# EAGLE design SkinProc_v0_1b (EAGLE 7.2.0)
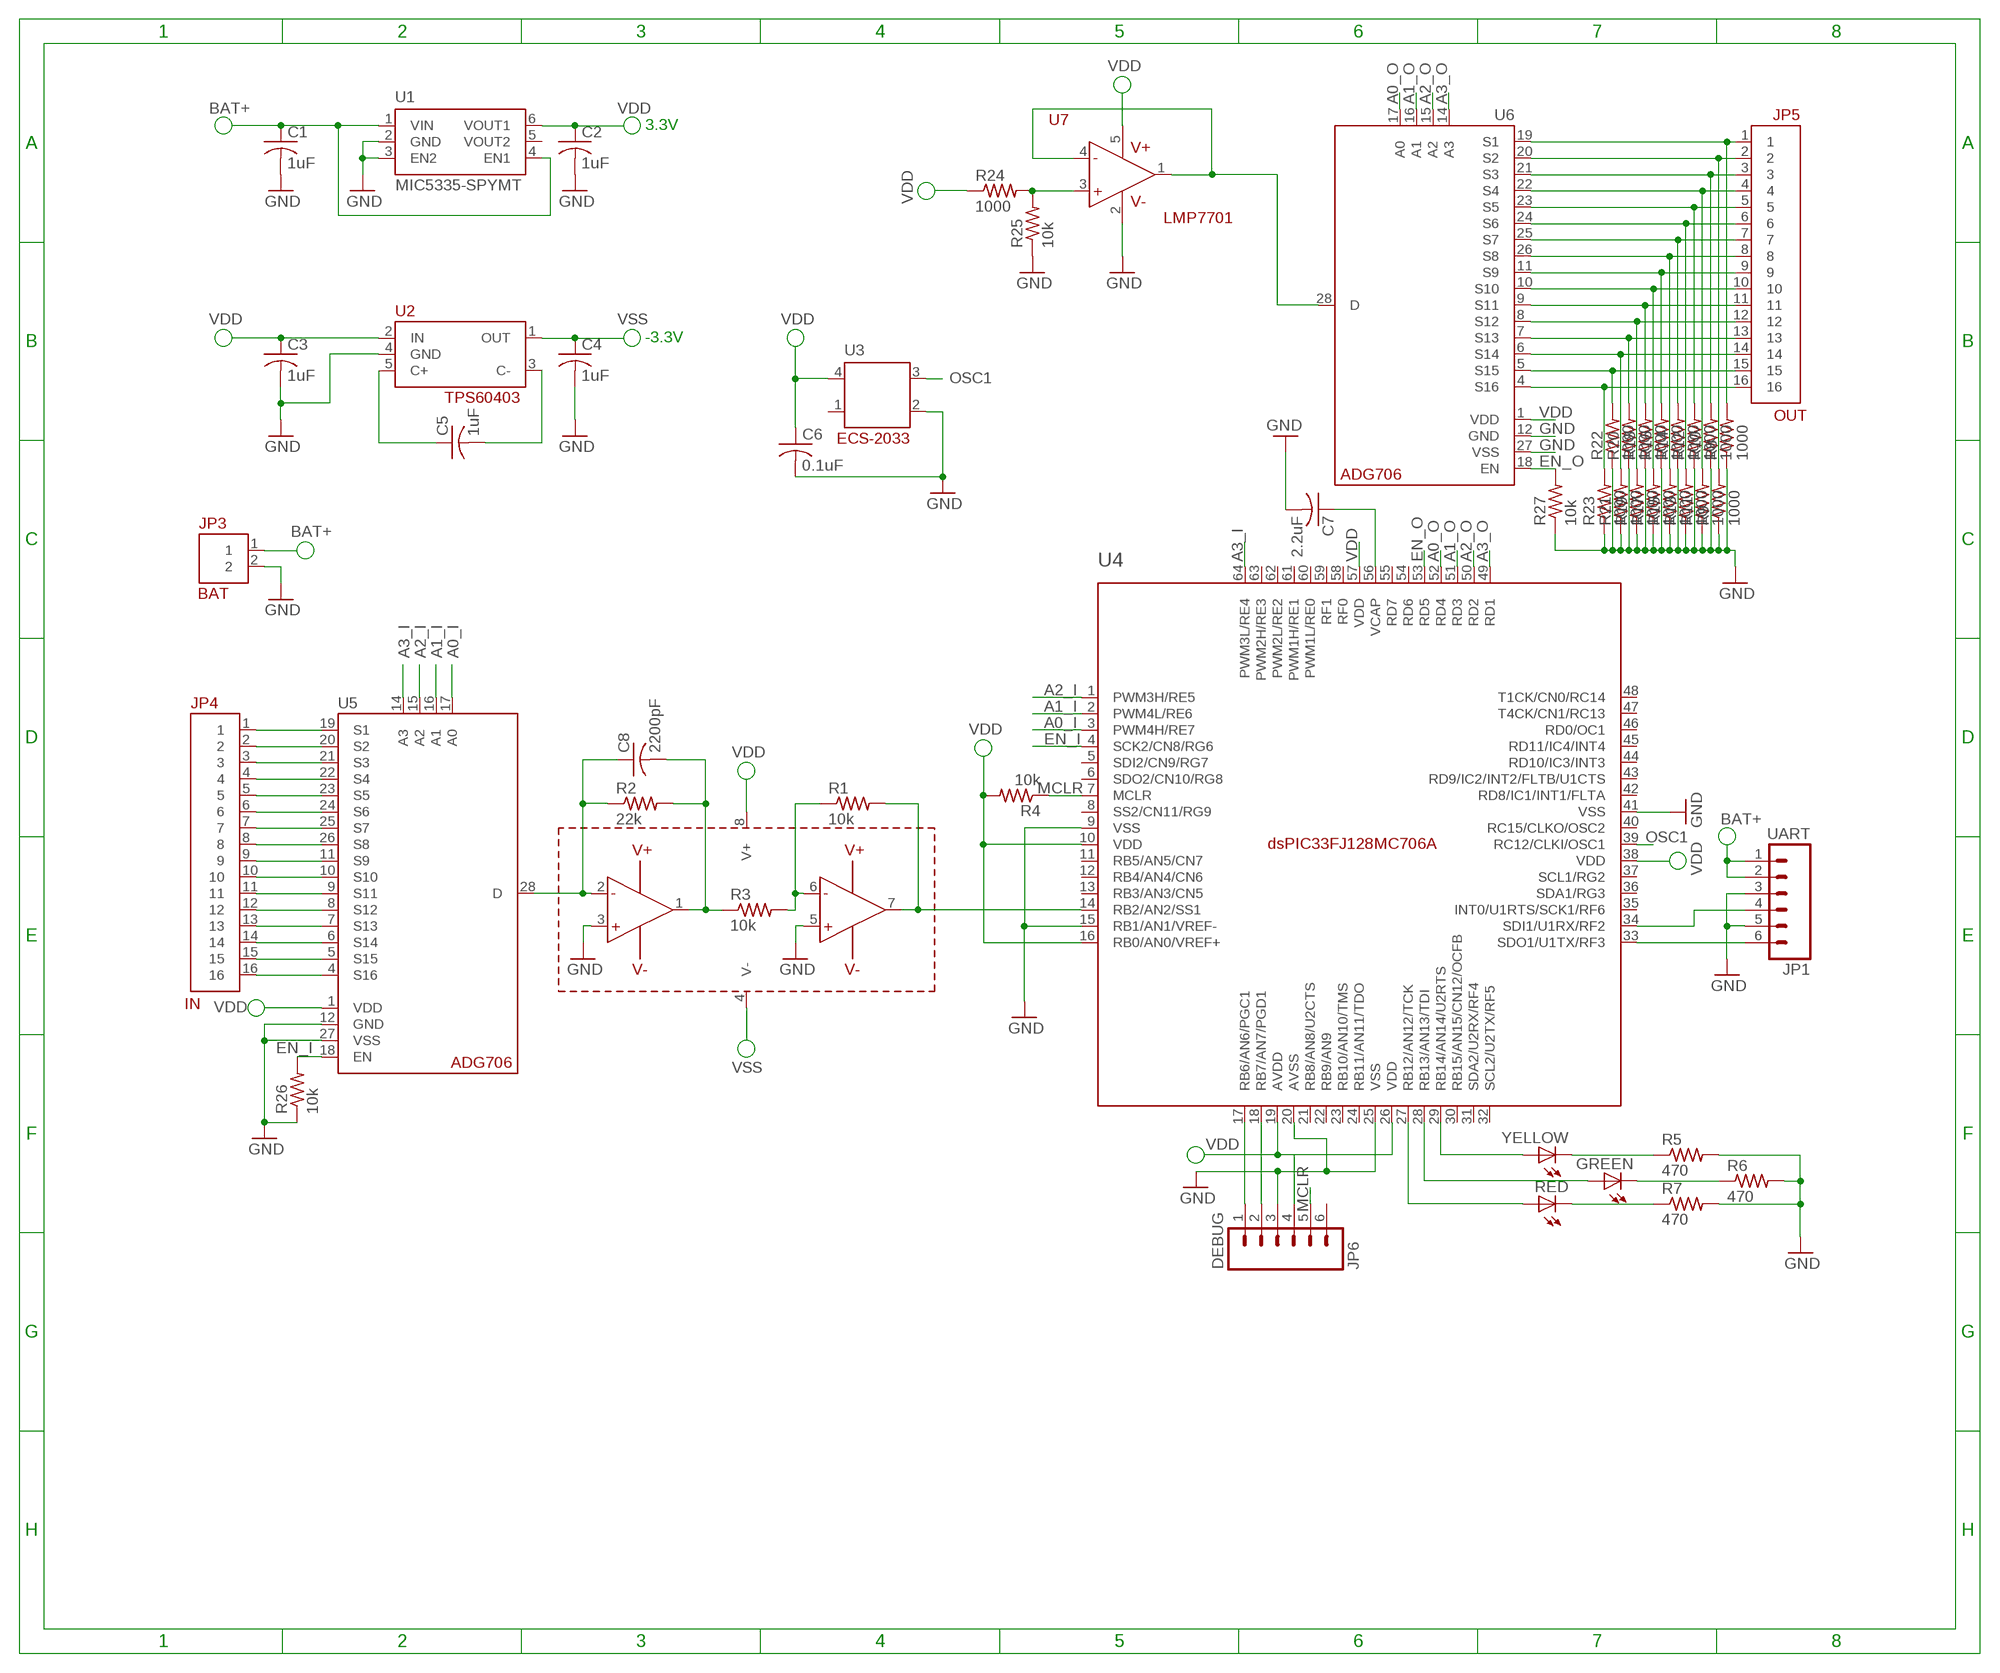
[diagram p0: schematic, sheet 1]

## Parts
C1  1uF  C-USC0402  [C0402]
C2  1uF  C-USC0402  [C0402]
C3  1uF  C-USC0402  [C0402]
C4  1uF  C-USC0402  [C0402]
C5  1uF  C-USC0402  [C0402]
C6  0.1uF  C-USC0402  [C0402]
C7  2.2uF  C-USC0402  [C0402]
C8  2200pF  C-USC0402  [C0402]
GREEN  LEDCHIP-LED0603  [CHIP-LED0603]
JP1  UART  MOLEX_503480-0600  [MOLEX_503480-0600]
JP3  BAT  2_PAD  [2_PAD]
JP4  IN  16_PAD  [16_PAD]
JP5  OUT  16_PAD  [16_PAD]
JP6  DEBUG  MOLEX_503480-0600  [MOLEX_503480-0600]
R1  10k  R-US_R0402  [R0402]
R2  22k  R-US_R0402  [R0402]
R3  10k  R-US_R0402  [R0402]
R4  10k  R-US_R0402  [R0402]
R5  470  R-US_R0402  [R0402]
R6  470  R-US_R0402  [R0402]
R7  470  R-US_R0402  [R0402]
R8  1000  R-US_R0402  [R0402]
R9  1000  R-US_R0402  [R0402]
R10  1000  R-US_R0402  [R0402]
R11  1000  R-US_R0402  [R0402]
R12  1000  R-US_R0402  [R0402]
R13  1000  R-US_R0402  [R0402]
R14  1000  R-US_R0402  [R0402]
R15  1000  R-US_R0402  [R0402]
R16  1000  R-US_R0402  [R0402]
R17  1000  R-US_R0402  [R0402]
R18  1000  R-US_R0402  [R0402]
R19  1000  R-US_R0402  [R0402]
R20  1000  R-US_R0402  [R0402]
R21  1000  R-US_R0402  [R0402]
R22  1000  R-US_R0402  [R0402]
R23  1000  R-US_R0402  [R0402]
R24  1000  R-US_R0402  [R0402]
R25  10k  R-US_R0402  [R0402]
R26  10k  R-US_R0402  [R0402]
R27  10k  R-US_R0402  [R0402]
RED  LEDCHIP-LED0603  [CHIP-LED0603]
U1  MIC5335-SPYMT  MIC5320-JGYML  [MLF-6]
U2  TPS60403  [SOT23-DBV]
U3  OSCILLATORS  [OSCILLATOR-SMD]
U4  DSPIC33FJ128MC706-I/PT  [TQFP64]
U5  ADG706  [TSSOP28]
U6  ADG706  [TSSOP28]
U7  LMP7701  NATIONAL_OP_AMP_SINGLE  [SOT23-DBV]
U8  NATIONAL_OP_AMP  [SO08]
YELLOW  LEDCHIP-LED0603  [CHIP-LED0603]

## Nets
A0_I: U4.3(PWM4H/RE7) U5.17(A0)
A0_O: U4.52(RD4) U6.17(A0)
A1_I: U4.2(PWM4L/RE6) U5.16(A1)
A1_O: U4.51(RD3) U6.16(A1)
A2_I: U4.1(PWM3H/RE5) U5.15(A2)
A2_O: U4.50(RD2) U6.15(A2)
A3_I: U4.64(PWM3L/RE4) U5.14(A3)
A3_O: U4.49(RD1) U6.14(A3)
BAT+: C1.1 JP1.1 JP1.2 JP3.1 U1.1(VIN) U1.4(EN1)
EN_I: R26.2 U4.4(SCK2/CN8/RG6) U5.18(EN)
EN_O: R27.2 U4.53(RD5) U6.18(EN)
GND: C1.2 C2.2 C3.2 C4.2 C6.2 C7.2 JP1.3 JP1.5 JP3.2 JP6.3 R5.2 R6.2 R7.2 R8.1 R9.1 R10.1 R11.1 R12.1 R13.1 R14.1 R15.1 R16.1 R17.1 R18.1 R19.1 R20.1 R21.1 R22.1 R23.1 R25.1 R26.1 R27.1 U1.2(GND) U1.3(EN2) U2.4(GND) U3.2(GND) U4.9(VSS) U4.15(RB1/AN1/VREF-) U4.20(AVSS) U4.25(VSS) U4.41(VSS) U5.12(GND) U5.27(VSS) U6.12(GND) U6.27(VSS) U7.2(V-) U8.3(+A) U8.5(+B)
IN1: JP4.1 U5.19(S1)
IN2: JP4.2 U5.20(S2)
IN3: JP4.3 U5.21(S3)
IN4: JP4.4 U5.22(S4)
IN5: JP4.5 U5.23(S5)
IN6: JP4.6 U5.24(S6)
IN7: JP4.7 U5.25(S7)
IN8: JP4.8 U5.26(S8)
IN9: JP4.9 U5.11(S9)
IN10: JP4.10 U5.10(S10)
IN11: JP4.11 U5.9(S11)
IN12: JP4.12 U5.8(S12)
IN13: JP4.13 U5.7(S13)
IN14: JP4.14 U5.6(S14)
IN15: JP4.15 U5.5(S15)
IN16: JP4.16 U5.4(S16)
MCLR: JP6.5 R4.1 U4.7(MCLR)
N$1: R1.2 U4.14(RB2/AN2/SS1) U8.7(VOUTB)
N$2: C5.1 U2.5(C+)
N$3: C7.1 U4.56(VCAP)
N$4: C5.2 U2.3(C-)
N$5: R5.1 YELLOW.C
N$7: JP6.1 U4.17(RB6/AN6/PGC1)
N$8: R1.1 R3.2 U8.6(-B)
N$9: C8.2 R2.2 R3.1 U8.1(VOUTA)
N$10: JP6.2 U4.18(RB7/AN7/PGD1)
N$11: C8.1 R2.1 U5.28(D) U8.2(-A)
N$12: JP1.4 U4.34(SDI1/U1RX/RF2)
N$13: JP1.6 U4.33(SDO1/U1TX/RF3)
N$14: R7.1 RED.C
N$15: GREEN.C R6.1
N$16: U4.29(RB14/AN14/U2RTS) YELLOW.A
N$17: GREEN.A U4.28(RB13/AN13/TDI)
N$18: RED.A U4.27(RB12/AN12/TCK)
N$23: U6.28(D) U7.1(VOUT) U7.4(-)
N$30: R24.2 R25.2 U7.3(+)
OSC1: U3.3(OUT) U4.39(RC12/CLKI/OSC1)
OUT1: JP5.1 R8.2 U6.19(S1)
OUT2: JP5.2 R9.2 U6.20(S2)
OUT3: JP5.3 R10.2 U6.21(S3)
OUT4: JP5.4 R11.2 U6.22(S4)
OUT5: JP5.5 R12.2 U6.23(S5)
OUT6: JP5.6 R13.2 U6.24(S6)
OUT7: JP5.7 R14.2 U6.25(S7)
OUT8: JP5.8 R15.2 U6.26(S8)
OUT9: JP5.9 R16.2 U6.11(S9)
OUT10: JP5.10 R17.2 U6.10(S10)
OUT11: JP5.11 R18.2 U6.9(S11)
OUT12: JP5.12 R19.2 U6.8(S12)
OUT13: JP5.13 R20.2 U6.7(S13)
OUT14: JP5.14 R21.2 U6.6(S14)
OUT15: JP5.15 R22.2 U6.5(S15)
OUT16: JP5.16 R23.2 U6.4(S16)
VDD: C2.1 C3.1 C6.1 JP6.4 R4.2 R24.1 U1.6(VOUT1) U2.2(IN) U3.4(VDD) U4.10(VDD) U4.16(RB0/AN0/VREF+) U4.19(AVDD) U4.26(VDD) U4.38(VDD) U4.57(VDD) U5.1(VDD) U6.1(VDD) U7.5(V+) U8.8(V+)
VSS: C4.1 U2.1(OUT) U8.4(V-)
Unconnected: JP6.6 U1.5(VOUT2) U3.1(NC) U4.5(SDI2/CN9/RG7) U4.6(SDO2/CN10/RG8) U4.8(SS2/CN11/RG9) U4.11(RB5/AN5/CN7) U4.12(RB4/AN4/CN6) U4.13(RB3/AN3/CN5) U4.21(RB8/AN8/U2CTS) U4.22(RB9/AN9) U4.23(RB10/AN10/TMS) U4.24(RB11/AN11/TDO) U4.30(RB15/AN15/CN12/OCFB) U4.31(SDA2/U2RX/RF4) U4.32(SCL2/U2TX/RF5) U4.35(INT0/U1RTS/SCK1/RF6) U4.36(SDA1/RG3) U4.37(SCL1/RG2) U4.40(RC15/CLKO/OSC2) U4.42(RD8/IC1/INT1/FLTA) U4.43(RD9/IC2/INT2/FLTB/U1CTS) U4.44(RD10/IC3/INT3) U4.45(RD11/IC4/INT4) U4.46(RD0/OC1) U4.47(T4CK/CN1/RC13) U4.48(T1CK/CN0/RC14) U4.54(RD6) U4.55(RD7) U4.58(RF0) U4.59(RF1) U4.60(PWM1L/RE0) U4.61(PWM1H/RE1) U4.62(PWM2L/RE2) U4.63(PWM2H/RE3)

## Notes on the sheet
- 3.3V
- -3.3V

## Library data of the parts
C1-C8 = rcl:C-US: CAPACITOR, American symbol
GREEN RED YELLOW = led:LED: LED OSRAM: - CHIPLED LG R971, LG N971, LY N971, LG Q971, LY Q971, LO R971, LY R971 LH N974, LH R974 LS Q976, LO Q976, LY Q976 LO Q996 - Hyper CHIPLED LW Q18S LB Q993, LB Q99A, LB R99A - SideLED LS A670, LO A670, LY A670, LG A670, LP A670 LB A673, LV A673, LT A673, LW A673 LH A674 LY A675 LS A676, LA A676, LO A676, LY A676, LW A676 LS A679, LY A679, LG A679 - Hyper Micro SIDELED® LS Y876, LA Y876, LO Y876, LY Y876 LT Y87S - SmartLED LW L88C, LW L88S LB L89C, LB L89S, LG L890 LS L89K, LO L89K, LY L89K LS L896, LA L896, LO L896, LY L896 - TOPLED LS T670, LO T670, LY T670, LG T670, LP T670 LSG T670, LSP T670, LSY T670, LOP T670, LYG T670 LG T671, LOG T671, LSG T671 LB T673, LV T673, LT T673, LW T673 LH T674 LS T676, LA T676, LO T676, LY T676, LB T676, LH T676, LSB T676, LW T676 LB T67C, LV T67C, LT T67C, LS T67K, LO T67K, LY T67K, LW E67C LS E67B, LA E67B, LO E67B, LY E67B, LB E67C, LV E67C, LT E67C LW T67C LS T679, LY T679, LG T679 LS T770, LO T770, LY T770, LG T770, LP T770 LB T773, LV T773, LT T773, LW T773 LH T774 LS E675, LA E675, LY E675, LS T675 LS T776, LA T776, LO T776, LY T776, LB T776 LHGB T686 LT T68C, LB T68C - Hyper Mini TOPLED® LB M676 - Mini TOPLED Santana® LG M470 LS M47K, LO M47K, LY M47K Source: http://www.osram.convergy.de LUXEON: - LUMILED® LXK2-PW12-R00, LXK2-PW12-S00, LXK2-PW14-U00, LXK2-PW14-V00 LXK2-PM12-R00, LXK2-PM12-S00, LXK2-PM14-U00 LXK2-PE12-Q00, LXK2-PE12-R00, LXK2-PE12-S00, LXK2-PE14-T00, LXK2-PE14-U00 LXK2-PB12-K00, LXK2-PB12-L00, LXK2-PB12-M00, LXK2-PB14-N00, LXK2-PB14-P00, LXK2-PB14-Q00 LXK2-PR12-L00, LXK2-PR12-M00, LXK2-PR14-Q00, LXK2-PR14-R00 LXK2-PD12-Q00, LXK2-PD12-R00, LXK2-PD12-S00 LXK2-PH12-R00, LXK2-PH12-S00 LXK2-PL12-P00, LXK2-PL12-Q00, LXK2-PL12-R00 Source: www.luxeon.com KINGBRIGHT: KA-3528ASYC Source: www.kingbright.com
JP1 JP6 = biomimetic:MOLEX_503480-0600
JP3 = SkinProc:2_PAD
JP4 JP5 = SkinProc:16_PAD
R1-R27 = rcl:R-US_: RESISTOR, American symbol
U1 = stan:MIC5320: MIC5320 High Performance Dual 150mA Voltage Regulator Package: NOT VERIFIED
U2 = SkinProc:TPS60403
U3 = stan:OSCILLATOR
U4 = stan:DSPIC33FJ128MC706: Microchip dsPIC33FJ128MC706
U5 U6 = SkinProc:ADG706: Analog Devices ADG706 16:1 Analog Mux
U7 = SkinProc:NATIONAL_OP_AMP_SINGLE
U8 = SkinProc:NATIONAL_OP_AMP: National Semiconductor LM6144/LMP7702 OP AMP

## Board
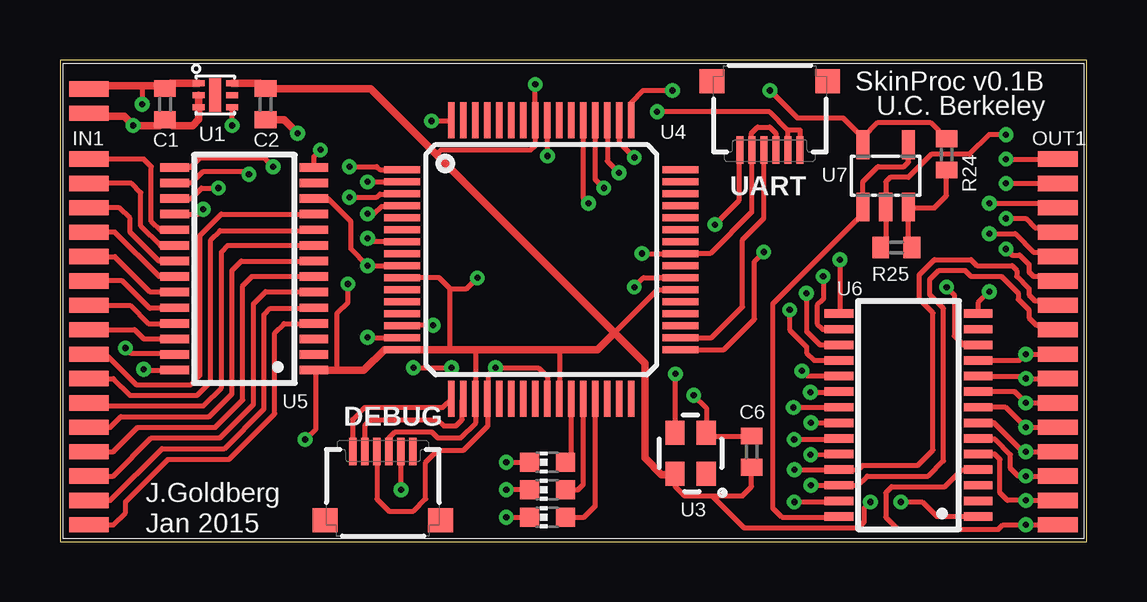
[diagram p1: board, top side]
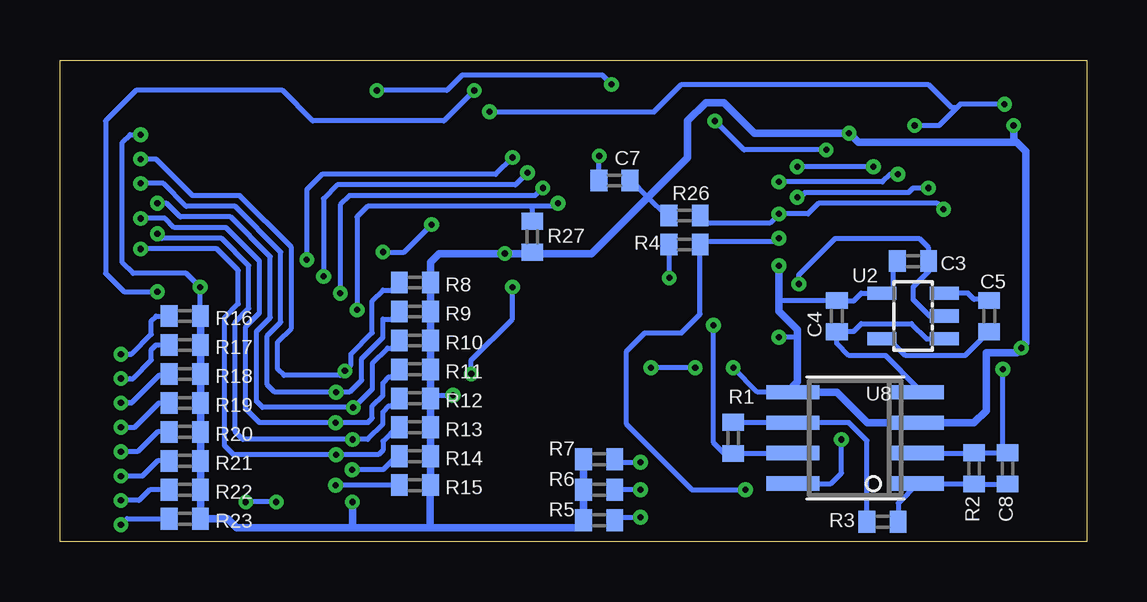
[diagram p2: board, bottom side, seen from below]

Size 42.8 x 20.07 mm. Coordinates in mm from the lower left corner, seen from the top.
Outline: 0,0 42.8,0 42.8,20.07 0,20.07 0,0
Copper layers (1*16): Top 2mil / dielectric 27mil / Bottom 2mil
Design rules "advancedcircuits-standard-biomimetic": minimum track width 5mil, minimum drill 10mil, track to track 5mil, track to pad 5mil, pad to pad 5mil, via to via 5mil, smd to smd 5mil, copper to edge 0.256540625mm, drill to drill 0.256540625mm, minimum pad ring 0.180340625mm, minimum via ring 0.180340625mm, stop-mask expansion 2mil, vias tented up to drill 0mil, thermal gap 10mil

### Footprints (pad centres in the part's own frame; a part is rotated, then mirrored left to right if it is on the bottom)
C0402 = smd 0.7 x 0.9: 1 -0.65,0; 2 0.65,0
CHIP-LED0603 = smd 0.8 x 0.8: A 0,-0.75; C 0,0.75
MOLEX_503480-0600 = smd 0.3 x 1.15: 1 -1.25,1.725; 2 -0.75,1.725; 3 -0.25,1.725; 4 0.25,1.725; 5 0.75,1.725; 6 1.25,1.725 | smd 1.035 x 1: L -2.408,-1.15; R 2.408,-1.15
2_PAD = smd 1.651 x 0.635: 1 0.953,1.46; 2 0.953,0.445
16_PAD = smd 1.651 x 0.635: 1 0.953,15.684; 2 0.953,14.668; 3 0.953,13.652; 4 0.953,12.636; 5 0.953,11.62; 6 0.953,10.604; 7 0.953,9.588; 8 0.953,8.572; 9 0.953,7.556; 10 0.953,6.54; 11 0.953,5.524; 12 0.953,4.508; 13 0.953,3.493; 14 0.953,2.477; 15 0.953,1.46; 16 0.953,0.445
R0402 = smd 0.7 x 0.9: 1 -0.65,0; 2 0.65,0
MLF-6 = smd 0.25 x 0.5: 1 -0.5,-0.7; 2 0,-0.7; 3 0.5,-0.7; 4 0.5,0.7; 5 0,0.7; 6 -0.5,0.7 | smd 1.4 x 0.5: P$1 0,0
SOT23-DBV = smd 0.55 x 1.2: 1 -0.95,-1.3; 2 0,-1.3; 3 0.95,-1.3; 4 0.95,1.3; 5 -0.95,1.3
OSCILLATOR-SMD = smd 1 x 0.8: 1 -0.85,-0.65; 2 0.85,-0.65; 3 0.85,0.65; 4 -0.85,0.65
TQFP64 = smd 1.5 x 0.28: 1 -5.8,3.75; 2 -5.8,3.25; 3 -5.8,2.75; 4 -5.8,2.25; 5 -5.8,1.75; 6 -5.8,1.25; 7 -5.8,0.75; 8 -5.8,0.25; 9 -5.8,-0.25; 10 -5.8,-0.75; 11 -5.8,-1.25; 12 -5.8,-1.75; 13 -5.8,-2.25; 14 -5.8,-2.75; 15 -5.8,-3.25; 16 -5.8,-3.75; 33 5.8,-3.75; 34 5.8,-3.25; 35 5.8,-2.75; 36 5.8,-2.25; 37 5.8,-1.75; 38 5.8,-1.25; 39 5.8,-0.75; 40 5.8,-0.25; 41 5.8,0.25; 42 5.8,0.75; 43 5.8,1.25; 44 5.8,1.75; 45 5.8,2.25; 46 5.8,2.75; 47 5.8,3.25; 48 5.8,3.75 | smd 0.28 x 1.5: 17 -3.75,-5.8; 18 -3.25,-5.8; 19 -2.75,-5.8; 20 -2.25,-5.8; 21 -1.75,-5.8; 22 -1.25,-5.8; 23 -0.75,-5.8; 24 -0.25,-5.8; 25 0.25,-5.8; 26 0.75,-5.8; 27 1.25,-5.8; 28 1.75,-5.8; 29 2.25,-5.8; 30 2.75,-5.8; 31 3.25,-5.8; 32 3.75,-5.8; 49 3.75,5.8; 50 3.25,5.8; 51 2.75,5.8; 52 2.25,5.8; 53 1.75,5.8; 54 1.25,5.8; 55 0.75,5.8; 56 0.25,5.8; 57 -0.25,5.8; 58 -0.75,5.8; 59 -1.25,5.8; 60 -1.75,5.8; 61 -2.25,5.8; 62 -2.75,5.8; 63 -3.25,5.8; 64 -3.75,5.8
TSSOP28 = smd 0.35 x 1.2: 1 -4.225,-2.9; 2 -3.575,-2.9; 3 -2.925,-2.9; 4 -2.275,-2.9; 5 -1.625,-2.9; 6 -0.975,-2.9; 7 -0.325,-2.9; 8 0.325,-2.9; 9 0.975,-2.9; 10 1.625,-2.9; 11 2.275,-2.9; 12 2.925,-2.9; 13 3.575,-2.9; 14 4.225,-2.9; 15 4.225,2.9; 16 3.575,2.9; 17 2.925,2.9; 18 2.275,2.9; 19 1.625,2.9; 20 0.975,2.9; 21 0.325,2.9; 22 -0.325,2.9; 23 -0.975,2.9; 24 -1.625,2.9; 25 -2.275,2.9; 26 -2.925,2.9; 27 -3.575,2.9; 28 -4.225,2.9
SO08 = smd 0.6 x 2.2: 1 -1.905,-2.6; 2 -0.635,-2.6; 3 0.635,-2.6; 4 1.905,-2.6; 5 1.905,2.6; 6 0.635,2.6; 7 -0.635,2.6; 8 -1.905,2.6

### Placement (x,y rotation side)
C1  4.38,18.22 270 top
C2  8.57,18.22 270 top
C3  7.24,11.68 180 bottom
C4  10.41,9.4 90 bottom
C5  4.06,9.4 90 bottom
C6  28.83,3.75 90 top
C7  19.68,15.05 0 bottom
C8  3.3,3.05 270 bottom
GREEN  20.32,2.16 90 top
JP1  29.59,18.03 180 top
JP3  0.25,17.4 0 top
JP4  0.25,0.25 0 top
JP5  40.64,0.25 0 top
JP6  13.46,2.03 0 top
R1  14.73,4.32 270 bottom
R2  4.7,3.05 270 bottom
R3  8.51,0.83 180 bottom
R4  16.76,12.38 180 bottom
R5  20.32,0.89 180 bottom
R6  20.32,2.16 180 bottom
R7  20.32,3.43 180 bottom
R8  28,10.79 180 bottom
R9  28,9.59 180 bottom
R10  28,8.38 180 bottom
R11  28,7.18 180 bottom
R12  28,5.97 180 bottom
R13  28,4.76 180 bottom
R14  28,3.56 180 bottom
R15  28,2.35 180 bottom
R16  37.59,9.4 180 bottom
R17  37.59,8.19 180 bottom
R18  37.59,6.99 180 bottom
R19  37.59,5.78 180 bottom
R20  37.59,4.57 180 bottom
R21  37.59,3.37 180 bottom
R22  37.59,2.16 180 bottom
R23  37.59,0.95 180 bottom
R24  36.96,16.13 270 top
R25  34.86,12.26 0 top
R26  16.76,13.59 0 bottom
R27  23.11,12.7 90 bottom
RED  20.32,3.3 90 top
U1  6.48,18.61 270 top
U2  7.24,9.4 90 bottom
U3  26.29,3.68 90 top
U4  20.07,11.75 0 top
U5  7.68,11.37 90 top
U6  35.37,5.27 90 top
U7  34.42,15.24 0 top
U8  9.65,4.32 90 bottom
YELLOW  20.32,1.02 90 top

### Tracks (layer width: path | path; a pad name or v marks a point on that pad's centre or on a via)
A0_I  (via drill 0.25)
  Top 0.203: U5.17 5.46,14.29 5.91,14.73 v6.6,14.73 | U4.3 14.25,14.48 13.34,14.48 13.21,14.35 v12.06,14.35
  Bottom 0.203: v6.6,14.73 7.24,14.73 7.43,14.54 11.75,14.54 11.94,14.35 v12.06,14.35
A0_O  (via drill 0.25)
  Top 0.203: U6.17 31.68,8.2 31.11,8.76 v31.11,10.35 | U4.52 22.32,15.09 v22.67,14.73
  Bottom 0.203: v22.67,14.73 22.99,14.41 30.73,14.41 31.11,14.03 v31.11,10.35
A1_I  (via drill 0.25)
  Top 0.203: U5.16 5.48,14.94 5.97,15.43 7.75,15.43 v7.87,15.3 | v12.83,14.99 14.26,14.99 U4.2
  Bottom 0.203: v7.87,15.3 8.19,15.3 8.51,14.99 v12.83,14.99
A1_O  (via drill 0.25)
  Top 0.203: U6.16 31.79,8.85 31.56,9.08 31.56,9.84 31.81,10.1 v31.81,11.05 | U4.51 22.82,15.86 v23.3,15.37
  Bottom 0.203: v31.81,11.05 31.81,14.29 31.24,14.86 23.81,14.86 v23.3,15.37
A2_I  (via drill 0.25)
  Top 0.203: U5.15 5.43,15.59 5.84,16 8.51,16 v8.89,15.62 | v12.06,15.62 13.21,15.62 13.34,15.49 U4.1
  Bottom 0.203: v8.89,15.62 v12.06,15.62
A2_O  (via drill 0.25)
  Top 0.203: U6.15 32.51,9.54 v32.51,11.75 | U4.50 23.3,17.54 23.3,16.64 v23.94,16
  Bottom 0.203: v32.51,11.75 32.51,14.67 31.88,15.3 24.64,15.3 v23.94,16
A3_I  (via drill 0.25)
  Top 0.203: U5.14 10.58,16.04 v10.86,16.32 | v15.49,17.53 16.29,17.53 U4.64
  Bottom 0.203: v10.86,16.32 14.29,16.32 v15.49,17.53
A3_O  (via drill 0.25)
  Top 0.203: U6.14 38.27,9.95 v38.73,10.41 | v25.53,18.8 24.32,18.8 23.81,18.29 U4.49
  Bottom 0.203: v38.73,10.41 40.13,10.41 40.89,11.18 40.89,17.53 39.62,18.8 33.53,18.8 32.26,17.53 26.8,17.53 v25.53,18.8
BAT+  (via drill 0.25)
  Top 0.203: U1.1 | U1.4 v7.18,17.34 | 3.43,18.99 v3.43,18.22 | JP1.1 30.86,16.33 30.86,17.14 30.35,17.14 | 30.35,17.14 29.59,17.91 v24.89,17.91 | JP1.2 30.35,16.32 30.35,17.14
  Top 0.305: U1.1 4.61,19.11 C1.1 | C1.1 4.37,18.99 | JP3.1 1.52,18.86 1.65,18.99 3.43,18.99 4.27,18.99 C1.1
  Bottom 0.203: v7.18,17.34 6.16,17.34 5.4,18.1 | 5.4,18.1 5.27,18.22 v3.43,18.22 | v24.89,17.91 18.03,17.91 16.89,19.05 6.6,19.05 5.65,18.1 5.4,18.1
EN_I  (via drill 0.25)
  Top 0.203: U5.18 5.77,13.64 v5.97,13.84 | v12.83,13.65 13.08,13.65 13.4,13.97 14.24,13.97 U4.4
  Bottom 0.203: v5.97,13.84 6.22,14.1 11.18,14.1 11.62,13.65 v12.83,13.65 13.21,13.27 15.88,13.27 16.11,13.51 R26.2
EN_O  (via drill 0.25)
  Top 0.203: 21.84,17.91 21.82,17.88 U4.53 21.82,14.32 v22.04,14.1 | U6.18 31.44,7.54 31.11,7.87 31.11,8.13 30.42,8.83 v30.42,9.65
  Bottom 0.203: v22.04,14.1 22.16,13.97 23.18,13.97 | 23.18,13.97 29.97,13.97 30.42,13.53 v30.42,9.65 | R27.2 23.11,13.91 23.18,13.97
GND  (via drill 0.25)
  Top 0.203: U6.27 32.42,1.65 v30.61,1.65 | U6.12 37.65,8.2 37.27,8.57 37.27,10.29 v36.96,10.6 | R25.1 34.42,12.46 U7.2 34.42,14.99 34.61,15.18 35.37,15.18 36.32,16.13 37.91,16.13 38.73,16.95 v39.43,16.95 | C6.2 27.08,4.4 U3.2 26.94,5.57 v26.42,6.1 | U4.15 12.84,8.5 v12.83,8.51 | U4.9 v12.83,11.5 v12.83,11.49 12.13,12.19 12.13,13.34 11.17,14.29 U5.12 | U4.25 20.32,6.86 19.94,7.24 v18.16,7.24 17.84,6.92 17.84,5.92 U4.20 17.84,5.95 17.84,4.83 16.83,3.81 15.75,3.81 15.24,3.3 15.24,1.78 14.73,1.27 13.72,1.27 13.21,1.77 JP6.3 | v14.73,7.24 v16.32,7.24 | v24.26,12 U4.41 27.11,12 28.83,13.72 28.83,16.3 JP1.5 28.83,16.32 28.83,17.02 29.08,17.27 29.59,17.27 29.84,17.02 JP1.3 | v2.73,8.06 2.94,7.86 4.72,7.86 U5.27
  Top 0.305: C2.2 9.35,17.57 v9.91,17.02 | JP3.2 1.59,17.84 1.71,17.72 2.67,17.72 v3.05,17.34 4.14,17.34 C1.2 4.46,17.57 4.7,17.34 5.52,17.34 5.78,17.59 U1.3 U1.2
  Bottom 0.203: R16.1 36.96,9.41 v36.96,10.6 37.53,11.18 39.75,11.18 40.2,11.62 40.2,16.64 39.88,16.95 v39.43,16.95 | U2.4 8.26,10.35 8.06,10.54 8.06,11.51 C3.2 | U2.4 8.44,10.35 | U2.4 9.4,10.35 9.72,10.03 10.4,10.03 C4.2 12.75,10.05 12.83,9.97 | 12.06,8.51 v12.83,8.51 | v16.32,7.24 v18.16,7.24 | U8.5 13.72,6.22 v14.73,7.24 | v26.42,6.1 27.23,6.1 R12.1 | C7.2 18.99,15.05 18.29,14.35 17.53,13.59 R26.1
  Bottom 0.305: R16.1 R17.1 R18.1 R19.1 R20.1 R21.1 R22.1 R23.1 35.81,0.95 35.43,0.57 30.61,0.57 | 30.61,0.57 v30.61,1.65 | R12.1 R11.1 R10.1 R9.1 R8.1 27.35,11.64 26.99,12 v24.26,12 23.43,12 23.38,12.05 R27.1 23.07,12 20.64,12 18.29,14.35 16.64,16 16.64,17.53 15.88,18.29 15.11,18.29 13.84,17.02 v9.91,17.02 9.53,16.64 3.05,16.64 | v12.83,11.49 12.83,9.97 12.83,9.59 12.06,8.83 12.06,8.51 12.06,6.67 12.25,6.48 U8.5 10.41,6.22 9.14,4.95 U8.3 4.7,4.95 4.19,5.46 4.19,7.87 2.92,7.87 v2.73,8.06 2.54,8.26 2.54,16.26 2.92,16.64 3.05,16.64 | 3.05,16.64 v3.05,17.34 | R7.2 R6.2 R5.2 21.29,0.57 27.43,0.57 | R12.1 27.35,5.89 27.18,5.71 | 27.43,0.57 30.61,0.57 | R12.1 R13.1 R14.1 R15.1 27.37,2.33 27.37,0.64 27.43,0.57
IN1
  Top 0.203: JP4.1 3.49,15.94 3.81,15.62 3.81,13.34 4.19,12.95 4.75,12.95 U5.19
IN2
  Top 0.203: JP4.2 2.98,14.92 3.37,14.54 3.37,13.14 4.19,12.32 4.76,12.32 U5.20
IN3
  Top 0.203: JP4.3 2.48,13.91 2.92,13.46 2.92,12.89 4.13,11.68 U5.21
IN4
  Top 0.203: JP4.4 2.29,12.89 4.13,11.05 U5.22
IN5
  Top 0.203: JP4.5 2.29,11.87 3.75,10.41 4.76,10.41 U5.23
IN6
  Top 0.203: JP4.6 2.6,10.86 3.75,9.72 4.76,9.72 U5.24
IN7
  Top 0.203: JP4.7 2.92,9.84 3.68,9.08 U5.25
IN8
  Top 0.203: JP4.8 3.11,8.83 3.49,8.45 U5.26
IN9
  Top 0.203: U5.11 6.72,13.64 5.84,12.76 5.84,6.92 5.46,6.54 3.17,6.54 2.03,7.68 1.33,7.68 JP4.9
IN10
  Top 0.203: JP4.10 2.22,6.79 2.92,6.1 5.71,6.1 6.29,6.67 6.29,12.57 6.67,12.95 10.55,12.95 U5.10
IN11
  Top 0.203: U5.9 7.01,12.34 6.73,12.06 6.73,6.41 5.97,5.65 1.33,5.65 JP4.11
IN12
  Top 0.203: 1.14,4.76 JP4.12 2.1,4.76 2.54,5.21 6.22,5.21 7.18,6.16 7.18,11.3 7.56,11.68 U5.8
IN13
  Top 0.203: JP4.13 2.22,3.75 3.24,4.76 6.48,4.76 7.62,5.91 7.62,10.67 8,11.05 U5.7
IN14
  Top 0.203: JP4.14 2.22,2.73 3.81,4.32 6.67,4.32 8.06,5.71 8.06,9.91 8.57,10.41 10.56,10.41 U5.6
IN15
  Top 0.203: JP4.15 2.1,1.71 4.25,3.87 6.86,3.87 8.51,5.52 8.51,9.46 8.76,9.72 10.56,9.72 U5.5
IN16
  Top 0.203: JP4.16 2.22,0.7 2.73,1.21 2.73,1.65 4.51,3.43 7.05,3.43 8.95,5.33 8.95,8.7 9.34,9.08 U5.4
MCLR  (via drill 0.25)
  Top 0.203: v12.83,12.64 12.95,12.51 14.25,12.51 U4.7 | v14.22,2.16 14.21,2.17 JP6.5
  Bottom 0.203: 12.97,12.49 v12.83,12.64 12.95,12.51 15.88,12.51 16,12.38 R4.1 16.11,9.48 16.89,8.7 18.41,8.7 19.18,7.94 19.18,4.89 16.45,2.16 v14.22,2.16
N$1  (via drill 0.25)
  Top 0.203: v15.56,9.02 14.29,9.02 U4.14
  Bottom 0.203: U8.7 12.27,3.67 R1.2 15.1,3.67 15.56,4.13 v15.56,9.02
N$2
  Bottom 0.203: U2.5 8.26,8.45 7.56,7.75 5.08,7.75 4.08,8.75 C5.1
N$3  (via drill 0.25)
  Top 0.203: U4.56 v20.32,16.07
  Bottom 0.203: v20.32,16.07 20.32,15.06 C7.1
N$4
  Bottom 0.203: U2.3 4.95,10.35 4.7,10.1 4.11,10.1 C5.2
N$5  (via drill 0.25)
  Top 0.203: v18.61,1.02 YELLOW.C
  Bottom 0.203: v18.61,1.02 19.54,1.02 R5.1
N$7
  Top 0.203: 16.29,5.97 U4.17 15.96,5.59 12.7,5.59 12.19,5.08 12.19,3.78 JP6.1
N$8
  Bottom 0.203: R1.1 14.72,4.95 U8.6 9.91,4.95 9.16,4.21 R3.2
N$9
  Bottom 0.203: U8.1 7.04,2.4 | R3.1 7.86,1.61 U8.1 | U8.1 4.7,2.41 R2.2 C8.2
N$10
  Top 0.203: 16.83,5.94 U4.18 16.76,5.9 16.76,5.08 16.51,4.83 16,4.83 15.75,5.08 12.95,5.08 12.7,4.83 12.71,4.81 JP6.2
N$11  (via drill 0.25)
  Top 0.203: U5.28 3.53,7.14 v3.49,7.18
  Bottom 0.203: 7.04,3.7 U8.2 4.7,3.68 R2.1 C8.1 3.49,3.7 v3.49,7.18
N$12
  Top 0.203: U4.34 27.17,8.5 28.45,9.78 28.45,12.57 29.34,13.47 JP1.4
N$13  (via drill 0.25)
  Top 0.203: U4.33 27.68,8 28.96,9.27 28.96,11.68 v29.34,12.06 | v27.3,13.21 28.32,14.22 28.32,16.29 JP1.6
  Bottom 0.203: v29.34,12.06 28.45,12.06 v27.3,13.21
N$14  (via drill 0.25)
  Top 0.203: v18.61,3.3 RED.C
  Bottom 0.203: v18.61,3.3 19.54,3.3 R7.1
N$15  (via drill 0.25)
  Top 0.203: GREEN.C v18.61,2.16
  Bottom 0.203: v18.61,2.16 R6.1
N$16
  Top 0.203: U4.29 22.32,1.49 21.84,1.02 YELLOW.A
N$17
  Top 0.203: U4.28 21.82,2.38 21.59,2.16 GREEN.A
N$18
  Top 0.203: U4.27 21.32,3.55 RED.A
N$23
  Top 0.203: U7.1 33.47,14.99 34.1,15.62 35.18,15.62 35.37,15.81 U7.4 | U7.1 | U7.1 33.47,13.65 29.72,9.91 29.72,1.4 30.1,1.02 32.44,1.02 U6.28
N$30
  Top 0.203: R25.2 35.37,12.4 U7.3 35.4,13.91 36.45,13.91 36.96,14.41 R24.2
OSC1  (via drill 0.25)
  Top 0.203: 24.96,10.99 25.85,10.99 U4.39 24.33,11 v23.94,10.6 | v25.65,6.99 25.65,4.55 U3.3
  Bottom 0.203: v23.94,10.6 23.94,9.27 25.65,7.56 v25.65,6.99
OUT1  (via drill 0.25)
  Top 0.203: v39.43,15.94 JP5.1 | v30.92,7.11 31.14,6.9 U6.19
  Top 0.406: 41.66,16 JP5.1
  Bottom 0.203: R8.2 28.97,10.48 29.34,10.48 29.78,10.03 29.78,8.7 30.67,7.81 30.67,7.37 v30.92,7.11 31.11,6.92 33.47,6.92 33.72,7.18 33.72,8.32 33.15,8.89 33.15,12.26 35.31,14.41 37.27,14.41 38.8,15.94 v39.43,15.94
OUT2  (via drill 0.25)
  Top 0.203: v31.29,6.22 32.45,6.22 U6.20 | v39.43,14.92 JP5.2
  Top 0.406: 41.66,14.99 JP5.2
  Bottom 0.203: R9.2 28.97,9.27 29.34,9.27 29.34,8.51 30.23,7.62 30.23,6.73 30.73,6.22 v31.29,6.22 33.85,6.22 34.16,6.54 34.16,8.57 33.59,9.14 33.59,12.06 35.5,13.97 37.53,13.97 38.48,14.92 v39.43,14.92
OUT3  (via drill 0.25)
  Top 0.203: v30.57,5.59 U6.21 | JP5.3 41.4,14.1 v38.73,14.1
  Bottom 0.203: R10.2 28.97,8.06 29.15,8.06 29.78,7.43 29.78,6.35 30.54,5.59 v30.57,5.59 34.35,5.59 34.61,5.84 34.61,8.76 34.04,9.34 34.04,11.87 35.69,13.53 37.78,13.53 38.35,14.1 v38.73,14.1
OUT4  (via drill 0.25)
  Top 0.203: v31.3,4.95 U6.22 | JP5.4 41.4,13.08 40.64,13.08 40.26,13.46 v39.43,13.46
  Bottom 0.203: R11.2 28.97,6.86 29.08,6.86 29.34,6.6 29.34,6.1 29.78,5.65 29.78,5.14 29.97,4.95 v31.3,4.95 34.48,4.95 35.05,5.52 35.05,8.95 34.48,9.53 34.48,11.68 35.88,13.08 38.04,13.08 38.42,13.46 v39.43,13.46
OUT5  (via drill 0.25)
  Top 0.203: JP5.5 41.27,11.87 41.08,12.06 40.58,12.06 39.81,12.83 v38.73,12.83 | v30.61,4.25 32.43,4.25 U6.23
  Bottom 0.203: R12.2 28.97,5.65 29.08,5.65 29.34,5.4 29.34,4.89 29.97,4.25 v30.61,4.25 35.18,4.25 35.5,4.57 35.5,9.14 34.92,9.72 34.92,11.49 36.07,12.64 38.54,12.64 v38.73,12.83
OUT6  (via drill 0.25)
  Top 0.203: v31.29,3.62 U6.24 | JP5.6 41.15,10.86 40.96,11.05 40.58,11.05 40.39,11.24 40.39,11.56 40.01,11.94 39.69,11.94 v39.43,12.19
  Bottom 0.203: v39.43,12.19 36.26,12.19 35.37,11.3 35.37,9.91 35.94,9.34 35.94,4 35.56,3.62 v31.29,3.62 29.53,3.62 29.34,3.81 29.34,4.19 28.77,4.76 R13.2
OUT7  (via drill 0.25)
  Top 0.203: U6.25 32.48,2.98 33.27,2.98 33.47,3.17 35.75,3.17 36.39,3.81 36.39,9.53 35.81,10.1 35.81,11.11 36.45,11.75 37.97,11.75 38.23,11.49 39.69,11.49 39.88,11.3 39.88,11.05 40.39,10.54 40.39,10.29 40.64,10.03 41.4,10.03 JP5.7 | U6.25 32.45,2.98 | U6.25 v30.62,3 30.61,2.98
  Bottom 0.203: v30.62,3 29.33,3 28.77,3.56 R14.2
OUT8  (via drill 0.25)
  Top 0.203: JP5.8 41.4,9.02 40.7,9.02 40.39,9.34 40.39,9.65 39.94,10.1 39.94,10.35 39.24,11.05 37.97,11.05 37.72,11.3 36.64,11.3 36.26,10.92 36.26,10.29 36.83,9.72 36.83,3.37 36.2,2.73 33.66,2.73 33.27,2.35 U6.26 v31.31,2.35 v31.3,2.35
  Bottom 0.203: R15.2 v31.3,2.35
OUT9  (via drill 0.25)
  Top 0.203: JP5.9 v40.26,7.81 39.99,7.54 U6.11
  Bottom 0.203: 39.88,7.81 v40.26,7.81 39.81,7.81 38.99,8.64 38.99,9.21 38.8,9.4 R16.2
OUT10  (via drill 0.25)
  Top 0.203: JP5.10 v40.26,6.79 40.16,6.9 U6.10
  Bottom 0.203: 39.88,6.79 v40.26,6.79 39.75,6.79 38.99,7.56 38.99,8 38.8,8.19 R17.2
OUT11  (via drill 0.25)
  Top 0.203: JP5.11 v40.26,5.78 39.79,6.25 U6.9
  Bottom 0.203: 39.88,5.78 v40.26,5.78 39.81,5.78 38.67,6.92 38.31,6.92 R18.2
OUT12  (via drill 0.25)
  Top 0.203: JP5.12 v40.26,4.76 39.43,5.6 U6.8
  Bottom 0.203: 39.88,4.76 v40.26,4.76 39.69,4.76 38.67,5.78 R19.2
OUT13  (via drill 0.25)
  Top 0.203: JP5.13 v40.26,3.75 40.13,3.75 38.93,4.95 U6.7
  Bottom 0.203: R20.2 38.73,4.57 39.56,3.75 v40.26,3.75
OUT14  (via drill 0.25)
  Top 0.203: JP5.14 v40.26,2.73 39.94,2.73 39.62,3.05 39.62,3.62 38.99,4.25 38.31,4.25 U6.6
  Bottom 0.203: v40.26,2.73 39.37,2.73 38.73,3.37 R21.2
OUT15  (via drill 0.25)
  Top 0.203: JP5.15 v40.26,1.71 39.5,1.71 39.18,2.03 39.18,3.43 38.96,3.65 U6.5
  Bottom 0.203: R22.2 39.05,2.16 39.5,1.71 v40.26,1.71
OUT16  (via drill 0.25)
  Top 0.203: JP5.16 v40.26,0.7 39.31,0.7 39.12,0.51 34.92,0.51 34.42,1.02 34.42,2.03 34.67,2.29 36.89,2.29 37.59,2.98 38.26,2.98 U6.4
  Bottom 0.203: R23.2 40.01,0.95 v40.26,0.7
VDD  (via drill 0.25)
  Top 0.203: R24.1 36.27,17.46 34.1,17.46 33.47,16.83 U7.5 33.47,16.82 32.64,17.65 30.73,17.65 v29.59,18.8 | C6.1 28.83,2.29 28.45,1.91 27.18,1.91 | 27.18,1.91 26.04,1.91 25.65,2.29 25.65,2.82 U3.4 | 20.06,8 20.07,8 | 17.34,8 17.32,7.98 U4.19 17.34,5.95 17.34,4.95 16.7,4.32 15.75,4.32 15.49,4.57 13.97,4.57 13.72,4.32 JP6.4 | 10.61,7.11 U5.1 | v12,10.73 12,9.97 11.56,9.53 11.56,7.14 | 10.67,7.11 10.67,4.7 v10.22,4.25 | U4.26 20.83,5.94 20.83,8 | 27.18,1.91 28.51,0.57 33.27,0.57 33.53,0.83 33.53,1.4 v33.78,1.65 | 15.68,16.13 15.88,16.32 19.62,16.32 19.82,16.51 U4.57 v19.81,19.05 | U4.38 24.91,10.5 23.11,8.7 | U4.10 15.8,11 16.26,10.54 | 16.26,8 16.26,10.54 | 16.26,10.54 16.95,10.54 v17.4,10.99 | U6.1 36.55,1.05 35.94,1.65 v35.05,1.65
  Top 0.305: U1.6 8.34,19.11 C2.1 12.94,18.88 15.68,16.13 23.11,8.7 | 10.67,7.11 10.61,7.11 | U3.4 25.6,2.79 25.08,2.79 24.38,3.49 24.38,7.43 23.11,8.7 | 23.11,8.7 22.41,8 20.83,8 20.06,8 17.34,8 16.26,8 U4.16 13.52,8 12.67,7.14 11.56,7.14 U5.1
  Bottom 0.203: C3.1 6.59,11.26 7.24,10.6 7.24,10.1 6.54,9.4 U2.2 | C3.1 6.59,11.54 6.48,11.43 | v12,10.73 12,11.11 10.48,12.64 6.99,12.64 6.6,12.26 6.6,11.7 C3.1 | v10.22,4.25 10.22,2.86 10.67,2.41 U8.8 | v29.59,18.8 26.67,18.8 26.04,19.43 20.19,19.43 v19.81,19.05 | v17.4,10.99 17.4,12.37 R4.2 | v33.78,1.65 v35.05,1.65
VSS
  Bottom 0.203: U2.1 6.67,8.45 7.3,9.08 9.4,9.08 9.72,8.76 10.4,8.76 C4.1 10.41,8.26 9.91,7.75 8.38,7.75 7.05,6.42 U8.4

### Text on the board
tPlace: SkinProc v0.1B | U.C. Berkeley | IN1 | OUT1 | J.Goldberg | Jan 2015